# Altium schematic sheet Power_Regulation.SchDoc
size A; SheetNumber: 2; SheetTotal: 10
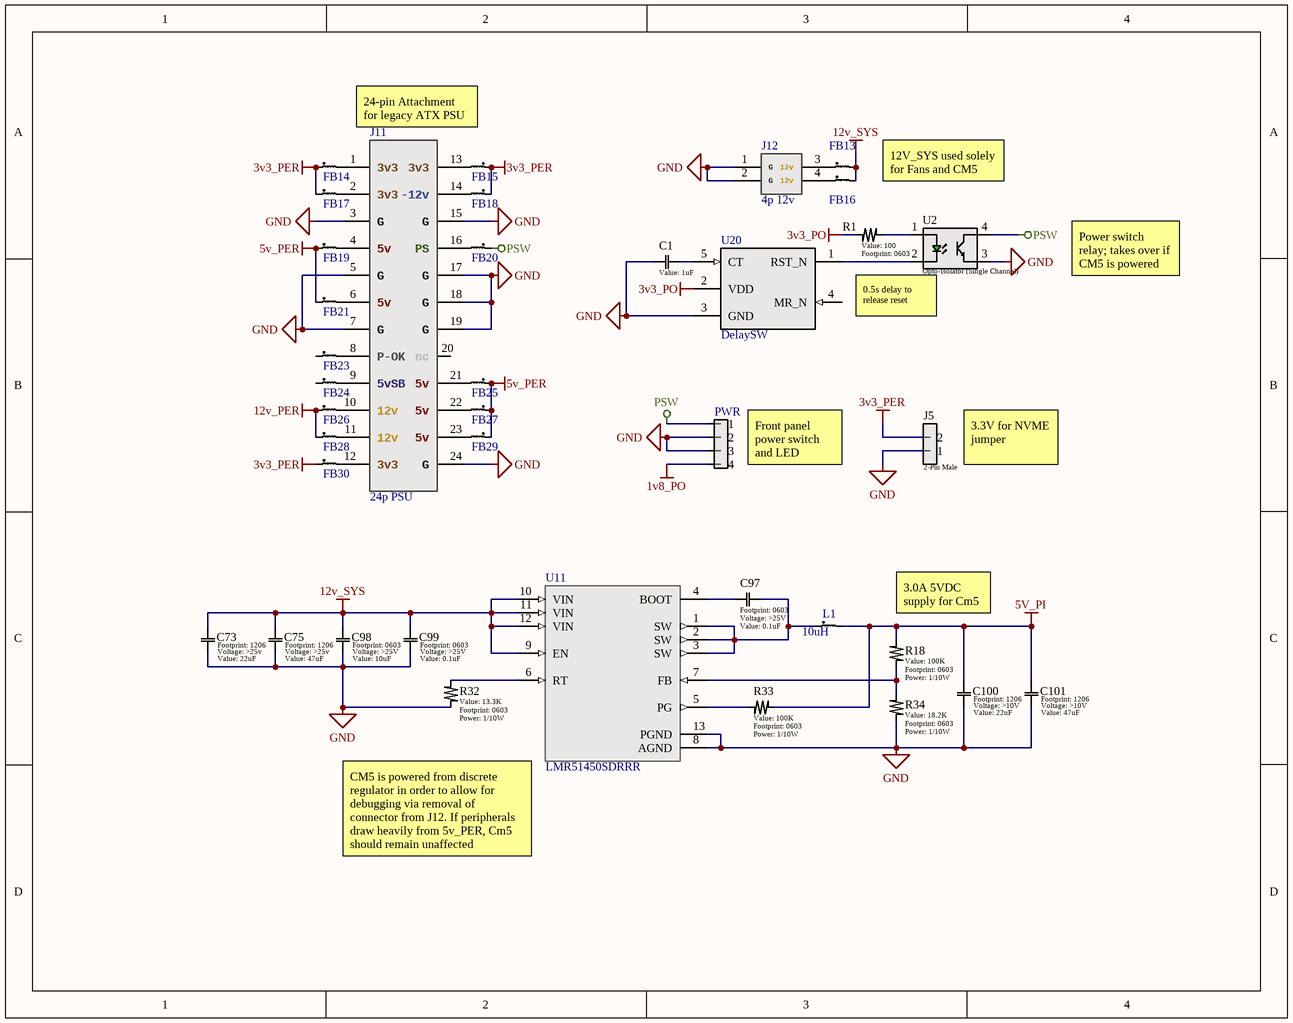
[diagram p0: Power_Regulation.SchDoc]

## Parts
C1  value 1uF  [0603]  (hidden comment: Generic Capacitor)
C73  value 22uF  Voltage: >25v  [1206]  (hidden comment: Generic Capacitor)
C75  value 47uF  Voltage: >25v  [1206]  (hidden comment: Generic Capacitor)
C97  value 0.1uF  Voltage: >25V  [0603]  (hidden comment: Generic Capacitor)
C98  value 10uF  Voltage: >25V  [0603]  (hidden comment: Generic Capacitor)
C99  value 0.1uF  Voltage: >25V  [0603]  (hidden comment: Generic Capacitor)
C100  value 22uF  Voltage: >10V  [1206]  (hidden comment: Generic Capacitor)
C101  value 47uF  Voltage: >10V  [1206]  (hidden comment: Generic Capacitor)
FB13  1206 Ferrite  [1206]  (value not drawn)
FB14  1206 Ferrite  [1206]  (value not drawn)
FB15  1206 Ferrite  [1206]  (value not drawn)
FB16  1206 Ferrite  [1206]  (value not drawn)
FB17  1206 Ferrite  [1206]  (value not drawn)
FB18  1206 Ferrite  [1206]  (value not drawn)
FB19  1206 Ferrite  [1206]  (value not drawn)
FB20  1206 Ferrite  [1206]  (value not drawn)
FB21  1206 Ferrite  [1206]  (value not drawn)
FB23  1206 Ferrite  [1206]  (value not drawn)
FB24  1206 Ferrite  [1206]  (value not drawn)
FB25  1206 Ferrite  [1206]  (value not drawn)
FB26  1206 Ferrite  [1206]  (value not drawn)
FB27  1206 Ferrite  [1206]  (value not drawn)
FB28  1206 Ferrite  [1206]  (value not drawn)
FB29  1206 Ferrite  [1206]  (value not drawn)
FB30  1206 Ferrite  [1206]  (value not drawn)
J5  2-Pin Male  [0022057025]
J11  24p PSU  [CONN_442060007_MOL]
J12  4p 12v  [CON_39281043]
L1  10uH  [SMD 8.2x8.6mm]
PWR  4-Pin Male Header (0.100" Pitch)  [TSW-104-07-T-S]  (value not drawn)
R1  value 100  [0603]  (hidden comment: Generic Resistor)
R18  value 100K  Power: 1/10W  [0603]  (hidden comment: Generic Resistor)
R32  value 13.3K  Power: 1/10W  [0603]  (hidden comment: Generic Resistor)
R33  value 100K  Power: 1/10W  [0603]  (hidden comment: Generic Resistor)
R34  value 18.2K  Power: 1/10W  [0603]  (hidden comment: Generic Resistor)
U2  Opto-Isolator (Single Channel)  [4-SMD (7.62mm Gull-Wing) Opto-Transistor]
U11  LMR51450SDRRR  [WSON-12]
U20  DelaySW  [TSOT-23-5]

## Nets
1v8_PO: PWR.4
3v3_PER: FB14.1 FB15.1 FB17.1 FB18.1 FB30.1 J5.2
3v3_PO: R1.1 U20.2(VDD)
5v_PER: FB19.1 FB21.1 FB25.1 FB27.1 FB29.1
5V_PI: C100.1 C101.1 L1.2 R18.2 R33.1
12v_PER: FB26.1 FB28.1
12v_SYS: C73.1 C75.1 C98.1 C99.1 FB13.2 FB16.2 U11.9(EN) U11.10(VIN) U11.11(VIN) U11.12(VIN)
GND: C1.2 C73.2 C75.2 C98.2 C99.2 C100.2 C101.2 J5.1 J11.3(G) J11.5(G) J11.7(G) J11.15(G) J11.17(G) J11.18(G) J11.19(G) J11.24(G) J12.1(G) J12.2(G) PWR.2 PWR.3 R32.1 R34.1 U2.3 U11.8(AGND) U11.13(PGND) U20.3(GND)
PSW: FB20.1 PWR.1 U2.4
NetC1_1: C1.1 U20.5(CT)
NetC97_1: C97.1 U11.4(BOOT)
NetC97_2: C97.2 L1.1 U11.1(SW) U11.2(SW) U11.3(SW)
NetFB13_1: FB13.1 J12.3(12v)
NetFB14_2: FB14.2 J11.1(3v3)
NetFB15_2: FB15.2 J11.13(3v3)
NetFB16_1: FB16.1 J12.4(12v)
NetFB17_2: FB17.2 J11.2(3v3)
NetFB18_2: FB18.2 J11.14(-12v)
NetFB19_2: FB19.2 J11.4(5v)
NetFB20_2: FB20.2 J11.16(PS)
NetFB21_2: FB21.2 J11.6(5v)
NetFB23_2: FB23.2 J11.8(P-OK)
NetFB24_2: FB24.2 J11.9(5vSB)
NetFB25_2: FB25.2 J11.21(5v)
NetFB26_2: FB26.2 J11.10(12v)
NetFB27_2: FB27.2 J11.22(5v)
NetFB28_2: FB28.2 J11.11(12v)
NetFB29_2: FB29.2 J11.23(5v)
NetFB30_2: FB30.2 J11.12(3v3)
NetR1_2: R1.2 U2.1
NetR18_1: R18.1 R34.2 U11.7(FB)
NetR32_2: R32.2 U11.6(RT)
NetR33_2: R33.2 U11.5(PG)
NetU2_2: U2.2 U20.1(RST_N)

Not connected (* = marked no-connect by the designer): FB23 1; FB24 1; J11 20(nc); U20 4(MR_N)

## Notes on the sheet
- 24-pin Attachment for legacy ATX PSU
- 12V_SYS used solely for Fans and CM5
- Power switch relay; takes over if CM5 is powered
- (near U2) 0.5s delay to release reset
- (near PWR) Front panel power switch and LED
- (near J5) 3.3V for NVME jumper
- (near R18) 3.0A 5VDC supply for Cm5
- (near U11) CM5 is powered from discrete regulator in order to allow for debugging via removal of connector from J12. If peripherals draw heavily from 5v_PER, Cm5 should remain unaffected
- REV
- REVISIONS
- DATE
- DESCRIPTION
- BY
- UNLESS OTHERWISE SPECIFIED, DRAWING DEFINITIONS AND TOLERANCES SHALL BE FOUND UNDER SUPPLIER STANDARDS SS-001. THIS PART AND ALL COMPONENTS OF IT MUST BE RoHS & REACH COMPLIANT. A CERTIFICATE OF COMPLIANCE MUST BE PROVIDED UPON REQUEST.
- ALL INFORMATION ON THIS DOCUMENT IS THE SOLE PROPERTY OF GAMBER-JOHNSON AND SHALL NOT BE COPIED, REPRODUCED, USED OR DISCLOSED IN WHOLE OR IN PART WITHOUT THE WRITTEN CONSENT OF GAMBER-JOHNSON
- TOLERANCES
  .00 ± .060
  .000 ± .020
  .0000 ± .005
  ANGELS ± 1°
- DRAWN BY:
- PROJECT NUMBER:
- SHEET TITLE:
- SHEET
- OF
- DATE:
- LOCATION:
- ASSEMBLY NUMBER
- SIZE
- GAMBER-JOHNSON LLC
  5001 JOERNS DR.
  STEVENS POINT, WI 54481
  +1 (715) 344-5209
- B

## Library data of the parts
C1 = Generic Capacitor: Voltage: 10V; Tolerance: 10%
C73 C75 C100 = Generic Capacitor: Tolerance: 20%
C97-C99 C101 = Generic Capacitor: Tolerance: 10%
FB13-FB21 FB23-FB30 = HI1206T161R-10: 160 Ohms @ 100MHz 1 Power, Signal Line Ferrite Bead 1206 (3216 Metric) 6A 18mOhm; Manufacturer 1: Laird Steward; DC Resistance (DCR): 18mR; Number of Lines: 1; Impedance: 160R; Supplier 1: Digi-Key; Manufacturer Part Number 1: HI1206T161R-10; RoHS: Yes; Category: Fixed Inductors; Stock 1: 250713; Pricing 1: 1=0.20000, 10=0.15600, 25=0.12920, 50=0.11140, 100=0.10020, 250=0.08464, 500=0.07572, 1000=0.06458 (USD); Mount: Surface Mount; Case/Package: 1206; Weight: 0.0136oz; Case Code (Metric): 3216; Case Code (Imperial): 1206; Core Material: Ferrite; Material: Ferrite; Min Operating Temperature: -40°C; Max Operating Temperature: 125°C; Package Quantity: 1; Packaging: Tape and Reel; Max Current Rating: 6A; Current Rating: 6A; Max DC Current: 6A; Termination: SMD/SMT; Frequency: 100MHz; Test Frequency: 100MHz; Length: 3.2mm; Height: 0.071inch; Width: 0.063inch; Depth: 1.8mm; Lead Free: Lead Free; REACH SVHC: Unknown; ComponentLink1URL: https://datasheet.ciiva.com/22622/1685743-22622771.pdf?src-supplier=Element14; ComponentLink1Description: https://datasheet.ciiva.com/22622/1685743-22622771.pdf?src-supplier=Element14; ComponentLink2URL: https://datasheet.ciiva.com/16714/70065439-16714326.pdf?src-supplier=Allied+Electronics; ComponentLink2Description: https://datasheet.ciiva.com/16714/70065439-16714326.pdf?src-supplier=Allied+Electronics; Supplier Part Number 1: 240-2411-1-ND; LCSC PN: C2926396
J5 = 0022057025: Conn Shrouded Header (4 Sides) HDR 2 POS 2.5mm Solder RA Thru-Hole SPOX™ Bag; Manufacturer 1: Molex; Number of Poles: 2; Voltage Rating: 250V; Contact Resistance: 20mR; Max Voltage Rating (DC): 250.25kV; Max Voltage Rating (AC): 125V; Current Rating: 3A; Insulation Resistance: 1GR; Connector Type: Male Pin; Shrouded: Yes (With); Test Voltage: 1kV; Glow Wire Compliant: Non-compliant; Supplier 1: RSComponents; Manufacturer Part Number 1: 22-05-7025; RoHS: Yes; Category: Headers and Wire Housings; Stock 1: 1440; Pricing 1: 10=0.40100, 250=0.36000, 1000=0.24900, 5000=0.22200, 10000=0.20700 (USD); Mount: Through Hole,Surface Mount; Contact Plating: Tin,Copper; Contact Material: Brass,Bronze; Housing Color: Natural; Housing Material: Nylon; Color: Natural; Material: Nylon,Polyamide; Insulation Material: Nylon; Min Operating Temperature: -40°C; Max Operating Temperature: 105°C; Packaging: Bulk; Gender: Male; Number of Rows: 1; Termination: Solder; Number of Contacts: 2; Orientation: Right Angle; Package Quantity: 1; Voltage Rating (AC): 250V; Number of Positions: 2; Working Voltage: 250V; Voltage Rating (DC): 250V; Number of Circuits: 2; Contact Gender: Male; Series: SPOX™ 5268; Contact Type: Male Pin; Length: 7.65mm; Height: 5.7mm; Pitch: 2.5mm; Depth: 5.1mm; Lead Pitch: 2.5mm; Contact Mating Length: 0.138inch; Radiation Hardening: No; RoHS Compliant: Yes; REACH SVHC: Unknown; Lead Free: Lead Free; Flammability Rating: UL94 V-0; ComponentLink1URL: https://datasheet.ciiva.com/711/022057025-sd-711958.pdf?src-supplier=Digi-Key; ComponentLink1Description: https://datasheet.ciiva.com/711/022057025-sd-711958.pdf?src-supplier=Digi-Key; ComponentLink2URL: https://datasheet.ciiva.com/25265/1766960-25265813.pdf?src-supplier=Newark; ComponentLink2Description: https://datasheet.ciiva.com/25265/1766960-25265813.pdf?src-supplier=Newark; ComponentLink3URL: https://datasheet.ciiva.com/5155/0022057025-pcb-headers-158480-5155683.pdf?src-supplier=Mouser; ComponentLink3Description: https://datasheet.ciiva.com/5155/0022057025-pcb-headers-158480-5155683.pdf?src-supplier=Mouser; ComponentLink4URL: https://datasheet.ciiva.com/19461/2017869-19461071.pdf?src-supplier=Jameco; ComponentLink4Description: https://datasheet.ciiva.com/19461/2017869-19461071.pdf?src-supplier=Jameco; ComponentLink5URL: https://datasheet.ciiva.com/11747/0900766b80da772b-11747276.pdf?src-supplier=RSComponents; ComponentLink5Description: https://datasheet.ciiva.com/11747/0900766b80da772b-11747276.pdf?src-supplier=RSComponents; ComponentLink6URL: https://datasheet.ciiva.com/7920/1877911-7920684.pdf?src-supplier=Element14; ComponentLink6Description: https://datasheet.ciiva.com/7920/1877911-7920684.pdf?src-supplier=Element14; ComponentLink7URL: https://datasheet.ciiva.com/9468/0022057025-pcb-headers-9468379.pdf?src-supplier=Avnet; ComponentLink7Description: https://datasheet.ciiva.com/9468/0022057025-pcb-headers-9468379.pdf?src-supplier=Avnet; Supplier Part Number 1: 6878086; LCSC PN: C918490
J11 = 442060007: Connector Header Through Hole 24 position 0.165" (4.20mm); Mfr_Name: Molex Connector Corporation; RefDes: RefDes; Type: Type; Supplier 1: Mouser; Supplier Part Number 1: 538-44206-0007; LCSC PN: C7541562
J12 = 39281043: Connector Header Through Hole 4 position 0.165" (4.20mm); Mfr_Name: Molex Connector Corporation; RefDes: RefDes; Type: Type; Supplier 1: Avnet; Supplier Part Number 1: 0039281043; LCSC PN: C2845777
L1 = IHLP3232DZER100M5A: 5.1A 10uH ±20% 5.2A - Power Inductor; Mfr_Name: Vishay; Type: DEV; Copyright: Copyright (C) 2023 Ultra Librarian. All rights reserved.; Manufacturer_Part_Number: IHLP3232DZER100M5A; RefDes: RefDes; LCSC PN: C2051768; Supplier 1: Mouser
PWR = TSW-104-07-T-S: Connector Header Through Hole 4 position 0.100" (2.54mm); Manufacturer 1: Samtec; Manufacturer Part Number 1: MTSW-104-07-T-S-170; Number of Contacts: 4; Supplier 1: Avnet; RoHS: Yes; Category: Connectors; Mount: Through Hole; Contact Plating: Tin; Contact Material: Bronze; Min Operating Temperature: -55°C; Max Operating Temperature: 105°C; Number of Rows: 1; Termination: Solder; Gender: Male; Packaging: Bulk; Orientation: Vertical; Pitch: 2.54mm; Radiation Hardening: No; RoHS Compliant: Yes; Lead Free: Lead Free; ComponentLink1URL: http://www.samtec.com/documents/webfiles/pdf/HMTSW.PDF?src-supplier=Avnet; ComponentLink1Description: http://www.samtec.com/documents/webfiles/pdf/HMTSW.PDF?src-supplier=Avnet; Supplier Part Number 1: MTSW-104-07-T-S-170
R1 = Generic Resistor: Tolerance: 1%; Power: 1/10W
R18 R32-R34 = Generic Resistor: Tolerance: 1%
U2 = LTV-816S: LTV Series Single Channel 80 V 5000 Vrms Transistor Output Optocoupler SMT-DIP-4; Manufacturer: Vishay Lite-On; Manufacturer Part Number: LTV-816S-TA1; Number of Channels: 1; Forward Voltage: 1.4V; Collector Emitter Voltage (VCEO): 80V; Rise Time: 18000ns; Output Current per Channel: 50mA; Collector Emitter Saturation Voltage: 200mV; Current Transfer Ratio: 320%; Isolation Voltage: 5kV; Input Type: DC; Max Power Dissipation: 200mW; Reverse Breakdown Voltage: 6V; Supplier 1: Digi-Key; RoHS: Yes; Category: Optocouplers; Stock 1: 2; Pricing 1: 1=0.45000, 10=0.27600, 100=0.15870 (USD); Mount: Surface Mount; Case/Package: SMD/SMT; Number of Pins: 4; Min Operating Temperature: -50°C; Max Operating Temperature: 110°C; Max Output Voltage: 80V; Packaging: Tape and Reel; Forward Current: 50mA; Fall Time: 18000ns; Max Input Current: 50mA; Collector-emitter Voltage-Max: 200mV; Series: -; Max Collector Current: 50mA; Number of Elements: 1; Power Dissipation: 200mW; Package Quantity: 1000; Output Voltage: 80V; Number of Circuits: 1; Isolation Voltage-Max: 5kV; Radiation Hardening: No; RoHS Compliant: Yes; Lead Free: Lead Free; ComponentLink1URL: https://datasheet.ciiva.com/15119/getdatasheetpartid-317372-15119066.pdf?src-supplier=Verical; ComponentLink1Description: https://datasheet.ciiva.com/15119/getdatasheetpartid-317372-15119066.pdf?src-supplier=Verical; ComponentLink2URL: https://datasheet.ciiva.com/6573/s-110-ltv-816826846m-s-s-ta-s-ta1-s-tpseries-6573992.pdf?src-supplier=Digi-Key; ComponentLink2Description: https://datasheet.ciiva.com/6573/s-110-ltv-816826846m-s-s-ta-s-ta1-s-tpseries-6573992.pdf?src-supplier=Digi-Key; ComponentLink3URL: https://datasheet.ciiva.com/6573/s-110-ltv-816826846m-s-s-ta-s-ta1-s-tpseries-6573991.pdf?src-supplier=Digi-Key; ComponentLink3Description: https://datasheet.ciiva.com/6573/s-110-ltv-816826846m-s-s-ta-s-ta1-s-tpseries-6573991.pdf?src-supplier=Digi-Key; ComponentLink4URL: https://datasheet.ciiva.com/6573/s-110-ltv-816826846m-s-s-ta-s-ta1-s-tpseries-6573993.pdf?src-supplier=Digi-Key; ComponentLink4Description: https://datasheet.ciiva.com/6573/s-110-ltv-816826846m-s-s-ta-s-ta1-s-tpseries-6573993.pdf?src-supplier=Digi-Key; Supplier Part Number 1: 160-1892-1-ND; LCSC PN: C92647
U11 = LMR51450SDRRR: 36-V, 5-A synchronous buck converter; MF: Texas Instruments; SnapEDA_Link: https://www.snapeda.com/parts/LMR51450SDRRR/Texas+Instruments/view-part/?ref=snap; Package: WSON-12 Texas Instruments; Value: *; MP: LMR51450SDRRR; Check_prices: https://www.snapeda.com/parts/LMR51450SDRRR/Texas+Instruments/view-part/?ref=eda; LCSC PN: C6890985
U20 = TPS3840DL22DBVR: Supervisor Open Drain or Open Collector 1 Channel SOT-23-5 / 2.2V Threshold; Mfr_Name: Texas Instruments; TYPE: TYPE; RefDes: RefDes; LCSC PN: C2867913; Supplier 1: Mouser; Supplier Part Number 1: 595-TPS3840DL22DBVR